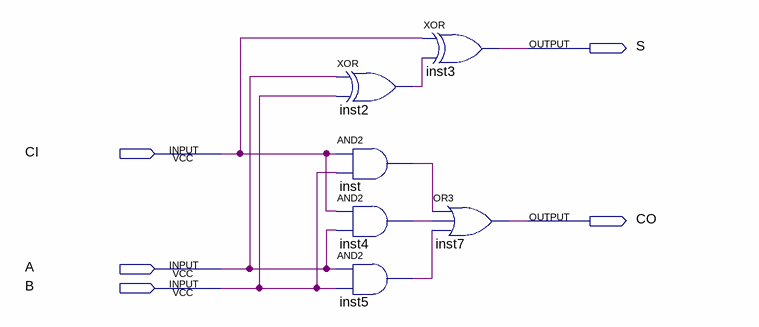
[diagram p0: schematic sheet]
// Quartus schematic FA.bdf as structural Verilog: 6 symbols, 5 pins
module FA (
  input  CI,
  input  A,
  input  B,
  output S,
  output CO
);

  wire inst2_out, inst4_out, inst5_out, inst_out;

  xor inst2 (inst2_out, A, B);
  and inst (inst_out, CI, B);
  and inst4 (inst4_out, CI, A);
  and inst5 (inst5_out, A, B);
  xor inst3 (S, CI, inst2_out);
  or inst7 (CO, inst_out, inst4_out, inst5_out);
endmodule
